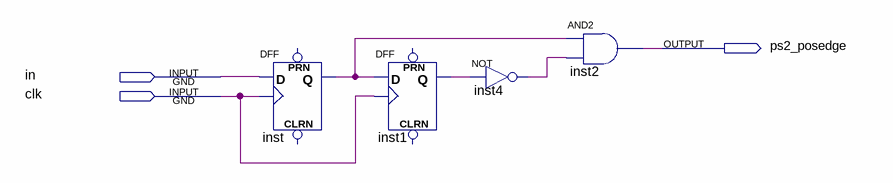
[diagram p0: schematic sheet]
// Quartus schematic ps2_posedge.bdf as structural Verilog: 4 symbols, 3 pins
module ps2_posedge (
  input  in,
  input  clk,
  output ps2_posedge
);

  wire inst1_q, inst4_out, inst_q;

  DFF inst (.CLK(clk), .D(in), .Q(inst_q));  // open: CLRN, PRN
  DFF inst1 (.CLK(clk), .D(inst_q), .Q(inst1_q));  // open: CLRN, PRN
  not inst4 (inst4_out, inst1_q);
  and inst2 (ps2_posedge, inst_q, inst4_out);
endmodule
